# Altium schematic sheet SI1125HD_replacement.SchDoc
size A1
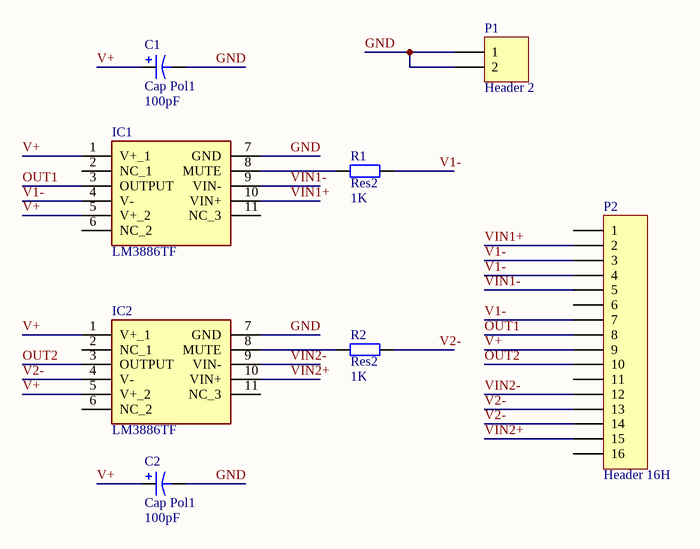
[diagram p0: SI1125HD_replacement.SchDoc]

## Parts
C1  Cap Pol1  value 100pF  [RB5-10.5]
C2  Cap Pol1  value 100pF  [RB5-10.5]
IC1  LM3886TF  [TO158P462X2002X2328-11P]
IC2  LM3886TF  [TO158P462X2002X2328-11P]
P1  Header 2  [HDR1X2]
P2  Header 16H  [HDR1X16H]
R1  Res2  value 1K  [AXIAL-0.4]
R2  Res2  value 1K  [AXIAL-0.4]

## Nets
GND: C1.2 C2.2 IC1.7(GND) IC2.7(GND) P1.1 P1.2
OUT1: IC1.3(OUTPUT) P2.8
OUT2: IC2.3(OUTPUT) P2.10
V1-: IC1.4(V-) P2.3 P2.4 P2.7 R1.2
V2-: IC2.4(V-) P2.13 P2.14 R2.2
V+: C1.1 C2.1 IC1.1(V+_1) IC1.5(V+_2) IC2.1(V+_1) IC2.5(V+_2) P2.9
VIN1+: IC1.10(VIN+) P2.2
VIN1-: IC1.9(VIN-) P2.5
VIN2+: IC2.10(VIN+) P2.15
VIN2-: IC2.9(VIN-) P2.12
NetIC1_8: IC1.8(MUTE) R1.1
NetIC2_8: IC2.8(MUTE) R2.1

Not connected (* = marked no-connect by the designer): IC1 2(NC_1) 6(NC_2) 11(NC_3); IC2 2(NC_1) 6(NC_2) 11(NC_3); P2 1 6 11 16

## Library data of the parts
C1 C2 = Cap Pol1: Polarized Capacitor (Radial); Published: 8-Jun-2000; LatestRevisionDate: 17-Jul-2002; LatestRevisionNote: Re-released for DXP Platform.; PackageReference: RB7.6-15; Publisher: Altium Limited; PackageDescription: Polarized Capacitor (Radial); 2 Leads
IC1 IC2 = LM3886TF: Integrated Circuit; Manufacturer_Name: Texas Instruments; Datasheet Link: http://www.ti.com/general/docs/lit/getliterature.tsp?genericPartNumber=LM3886&fileType=pdf; Height: 4.62mm; Manufacturer_Part_Number: LM3886TF; Arrow Part Number: LM3886TF; Arrow Price/Stock: https://www.arrow.com/en/products/lm3886tf/texas-instruments; Mouser Part Number: 926-LM3886TF; Mouser Price/Stock: https://www.mouser.co.uk/ProductDetail/Texas-Instruments/LM3886TF?qs=QbsRYf82W3EGenm0NUw7Ug%3D%3D
P1 = Header 2: Header, 2-Pin; LatestRevisionDate: 17-Jul-2002; LatestRevisionNote: Re-released for DXP Platform.; Publisher: Altium Limited
P2 = Header 16H: Header, 16-Pin, Right Angle; LatestRevisionDate: 17-Jul-2002; LatestRevisionNote: Re-released for DXP Platform.; Publisher: Altium Limited
R1 R2 = Res2: Resistor; Published: 8-Jun-2000; LatestRevisionDate: 17-Jul-2002; LatestRevisionNote: Re-released for DXP Platform.; PackageReference: AXIAL-0.4; Publisher: Altium Limited; PackageDescription: Axial Device, Thru-Hole; 2 Leads; 0.4 in Pin Spacing